# EAGLE schematic pmod-cape (EAGLE 7.5.3)

## Sheet 1 of 2: CN1
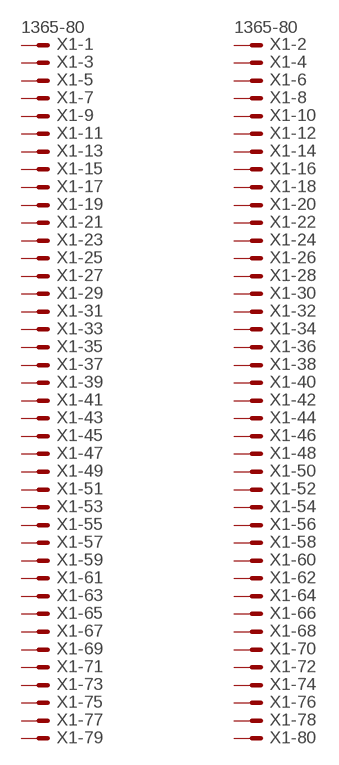
[diagram p0: schematic, sheet 1]

### Parts
X1  1365-80  [1365-80]
Unconnected: X1.1 X1.2 X1.3 X1.4 X1.5 X1.6 X1.7 X1.8 X1.9 X1.10 X1.11 X1.12 X1.13 X1.14 X1.15 X1.16 X1.17 X1.18 X1.19 X1.20 X1.21 X1.22 X1.23 X1.24 X1.25 X1.26 X1.27 X1.28 X1.29 X1.30 X1.31 X1.32 X1.33 X1.34 X1.35 X1.36 X1.37 X1.38 X1.39 X1.40 X1.41 X1.42 X1.43 X1.44 X1.45 X1.46 X1.47 X1.48 X1.49 X1.50 X1.51 X1.52 X1.53 X1.54 X1.55 X1.56 X1.57 X1.58 X1.59 X1.60 X1.61 X1.62 X1.63 X1.64 X1.65 X1.66 X1.67 X1.68 X1.69 X1.70 X1.71 X1.72 X1.73 X1.74 X1.75 X1.76 X1.77 X1.78 X1.79 X1.80

## Sheet 2 of 2: CN2
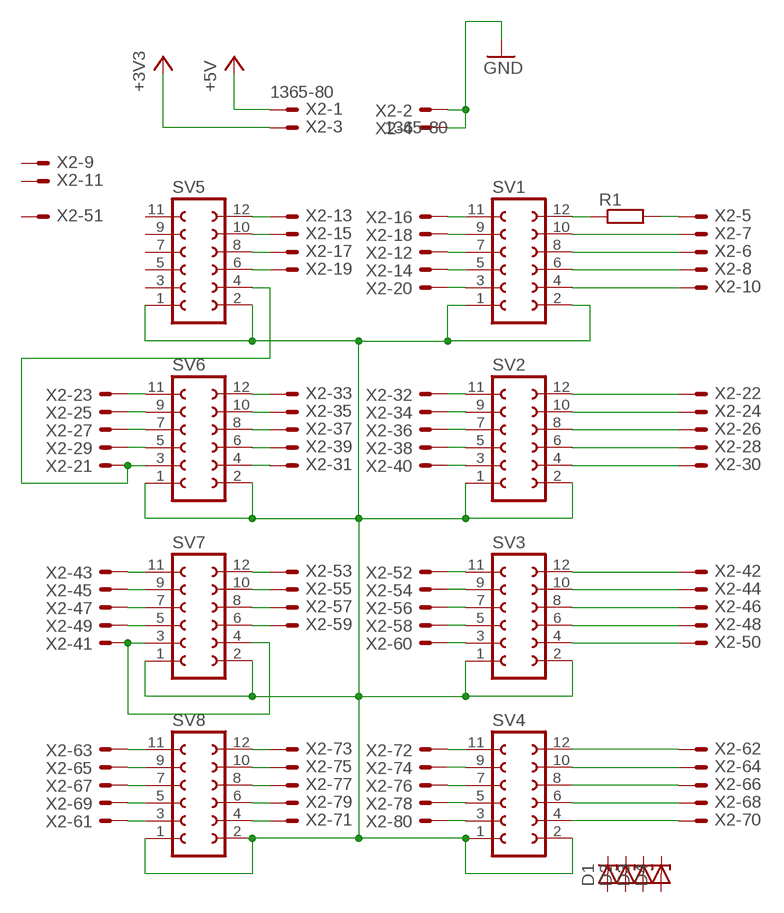
[diagram p1: schematic, sheet 2]

### Parts
D1  ZENER-DIODESOD80C  [SOD80C]
D2  ZENER-DIODESOD80C  [SOD80C]
D3  ZENER-DIODESOD80C  [SOD80C]
D4  ZENER-DIODESOD80C  [SOD80C]
R1  R-EU_R0805  [R0805]
SV1  FE06-2W  [FE06-2W]
SV2  FE06-2W  [FE06-2W]
SV3  FE06-2W  [FE06-2W]
SV4  FE06-2W  [FE06-2W]
SV5  FE06-2W  [FE06-2W]
SV6  FE06-2W  [FE06-2W]
SV7  FE06-2W  [FE06-2W]
SV8  FE06-2W  [FE06-2W]
X2  1365-80  [1365-80]

### Nets
+3V3: X2.3
+5V: X2.1
GND: X2.2 X2.4
N$1: SV4.12 X2.62
N$2: SV4.3 X2.80
N$3: SV4.5 X2.78
N$4: SV4.7 X2.76
N$5: SV4.9 X2.74
N$6: SV4.11 X2.72
N$7: SV4.10 X2.64
N$8: SV4.8 X2.66
N$9: SV4.6 X2.68
N$10: SV4.4 X2.70
N$11: SV3.11 X2.52
N$12: SV3.9 X2.54
N$13: SV3.7 X2.56
N$14: SV3.5 X2.58
N$15: SV3.3 X2.60
N$16: SV3.12 X2.42
N$17: SV3.10 X2.44
N$18: SV3.8 X2.46
N$19: SV3.6 X2.48
N$20: SV3.4 X2.50
N$21: SV2.11 X2.32
N$22: SV2.9 X2.34
N$23: SV2.7 X2.36
N$24: SV2.5 X2.38
N$25: SV2.3 X2.40
N$26: SV2.12 X2.22
N$27: SV2.10 X2.24
N$28: SV2.8 X2.26
N$29: SV2.6 X2.28
N$30: SV2.4 X2.30
N$31: SV1.5 X2.14
N$32: SV1.7 X2.12
N$33: SV1.9 X2.18
N$34: SV1.11 X2.16
N$35: SV1.3 X2.20
N$36: SV1.4 X2.10
N$37: SV1.6 X2.8
N$38: SV1.8 X2.6
N$39: SV1.10 X2.7
N$40: R1.1 SV1.12
N$41: SV8.12 X2.73
N$42: SV8.10 X2.75
N$43: SV8.8 X2.77
N$44: SV8.6 X2.79
N$45: SV8.4 X2.71
N$46: SV8.5 X2.69
N$47: SV8.7 X2.67
N$48: SV8.9 X2.65
N$49: SV8.11 X2.63
N$50: SV8.3 X2.61
N$51: SV7.12 X2.53
N$52: SV7.10 X2.55
N$53: SV7.8 X2.57
N$54: SV7.6 X2.59
N$55: SV7.5 X2.49
N$56: SV7.7 X2.47
N$57: SV7.9 X2.45
N$58: SV7.11 X2.43
N$59: R1.2 X2.5
N$60: SV6.12 X2.33
N$61: SV6.10 X2.35
N$62: SV6.8 X2.37
N$63: SV6.6 X2.39
N$64: SV6.4 X2.31
N$65: SV6.11 X2.23
N$66: SV6.9 X2.25
N$67: SV6.7 X2.27
N$68: SV6.5 X2.29
N$69: SV5.4 SV6.3 X2.21
N$70: SV5.12 X2.13
N$71: SV5.10 X2.15
N$72: SV5.8 X2.17
N$73: SV5.6 X2.19
N$78: SV1.1 SV1.2 SV2.1 SV2.2 SV3.1 SV3.2 SV4.1 SV4.2 SV5.1 SV5.2 SV6.1 SV6.2 SV7.1 SV7.2 SV8.1 SV8.2
N$83: SV7.3 SV7.4 X2.41
Unconnected: D1.A D1.C D2.A D2.C D3.A D3.C D4.A D4.C SV5.3 SV5.5 SV5.7 SV5.9 SV5.11 X2.9 X2.11 X2.51

## Library data of the parts
D1-D4 = diode:ZENER-DIODE: Z-Diode
R1 = rcl:R-EU_: RESISTOR, European symbol
SV1-SV8 = con-lsta:FE06-2W: FEMALE HEADER; OC_FARNELL: unknown; OC_NEWARK: unknown
X1 X2 = con-leotronics:1365-80: DUAL ROW STRAIGHT HEADER 1364 SERIES. 1.27mm x 1.27mm. Without Fixing Post. SMT Source: http://www.leotronics.co.uk/Conexcon/Data%20Sheets/sec.%20A/1364ing.pdf; OC_FARNELL: unknown; OC_NEWARK: unknown